# Altium project F429_CORE.PrjPcb
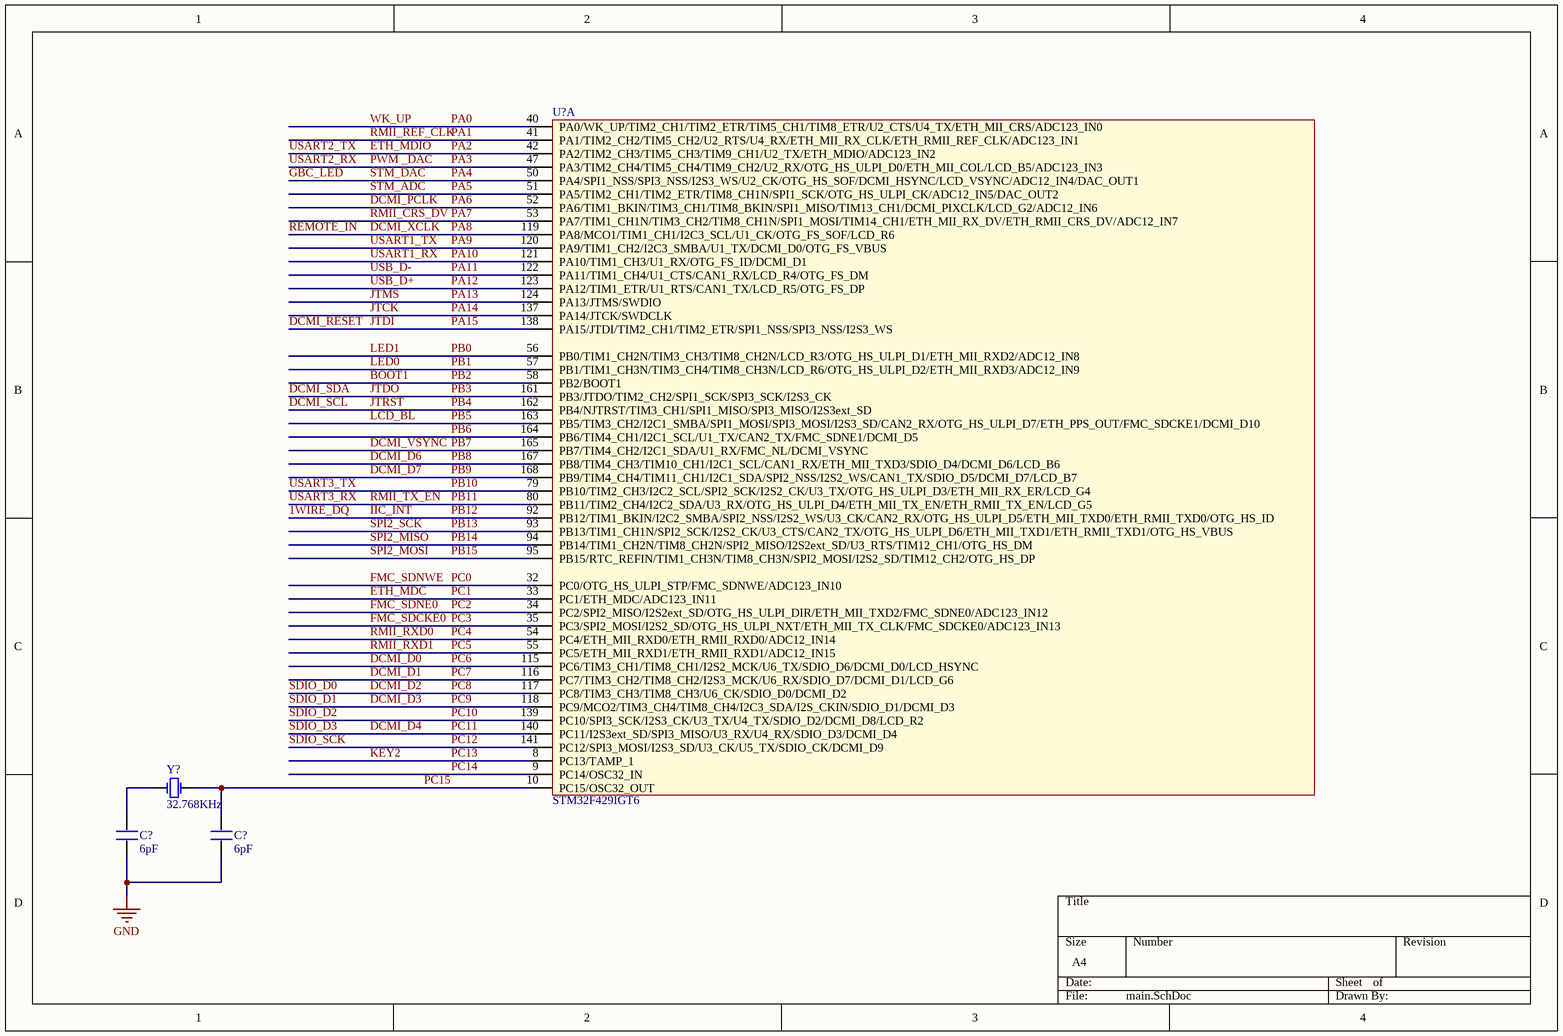
[diagram p0: main.SchDoc]
3 sheets, 26 parts. Net scope: global (net labels, ports and power ports of the same name join across sheets).
Board file: main.PcbDoc
Sheets:
  main.SchDoc
  main-2.SchDoc
  main-3.SchDoc

## Sheet main.SchDoc
size A4

### Parts
(Parts that share a designator on the sheet are numbered #1, #2 ... from top to bottom, then left to right.)
C?#1  6pF  [0402]
C?#2  6pF  [0402]
U?#1  STM32F429IGT6  [LQFP176]  (part A of 3)
Y?#1  32.768KHz  [XTAL3215]

### Nets
GND: C?#1.2 C?#2.1
1WIRE_DQ: U?#1.92(PB12/TIM1_BKIN/I2C2_SMBA/SPI2_NSS/I2S2_WS/U3_CK/CAN2_RX/OTG_HS_ULPI_D5/ETH_MII_TXD0/ETH_RMII_TXD0/OTG_HS_ID)  [also labelled IIC_INT, PB12]
BOOT1: U?#1.58(PB2/BOOT1)  [also labelled PB2]
DCMI_D0: U?#1.115(PC6/TIM3_CH1/TIM8_CH1/I2S2_MCK/U6_TX/SDIO_D6/DCMI_D0/LCD_HSYNC)  [also labelled PC6]
DCMI_D1: U?#1.116(PC7/TIM3_CH2/TIM8_CH2/I2S3_MCK/U6_RX/SDIO_D7/DCMI_D1/LCD_G6)  [also labelled PC7]
DCMI_D2: U?#1.117(PC8/TIM3_CH3/TIM8_CH3/U6_CK/SDIO_D0/DCMI_D2)  [also labelled PC8, SDIO_D0]
DCMI_D3: U?#1.118(PC9/MCO2/TIM3_CH4/TIM8_CH4/I2C3_SDA/I2S_CKIN/SDIO_D1/DCMI_D3)  [also labelled PC9, SDIO_D1]
DCMI_D4: U?#1.140(PC11/I2S3ext_SD/SPI3_MISO/U3_RX/U4_RX/SDIO_D3/DCMI_D4)  [also labelled PC11, SDIO_D3]
DCMI_D6: U?#1.167(PB8/TIM4_CH3/TIM10_CH1/I2C1_SCL/CAN1_RX/ETH_MII_TXD3/SDIO_D4/DCMI_D6/LCD_B6)  [also labelled PB8]
DCMI_D7: U?#1.168(PB9/TIM4_CH4/TIM11_CH1/I2C1_SDA/SPI2_NSS/I2S2_WS/CAN1_TX/SDIO_D5/DCMI_D7/LCD_B7)  [also labelled PB9]
DCMI_PCLK: U?#1.52(PA6/TIM1_BKIN/TIM3_CH1/TIM8_BKIN/SPI1_MISO/TIM13_CH1/DCMI_PIXCLK/LCD_G2/ADC12_IN6)  [also labelled PA6]
DCMI_RESET: U?#1.138(PA15/JTDI/TIM2_CH1/TIM2_ETR/SPI1_NSS/SPI3_NSS/I2S3_WS)  [also labelled JTDI, PA15]
DCMI_SCL: U?#1.162(PB4/NJTRST/TIM3_CH1/SPI1_MISO/SPI3_MISO/I2S3ext_SD)  [also labelled JTRST, PB4]
DCMI_SDA: U?#1.161(PB3/JTDO/TIM2_CH2/SPI1_SCK/SPI3_SCK/I2S3_CK)  [also labelled JTDO, PB3]
DCMI_VSYNC: U?#1.165(PB7/TIM4_CH2/I2C1_SDA/U1_RX/FMC_NL/DCMI_VSYNC)  [also labelled PB7]
DCMI_XCLK: U?#1.119(PA8/MCO1/TIM1_CH1/I2C3_SCL/U1_CK/OTG_FS_SOF/LCD_R6)  [also labelled PA8, REMOTE_IN]
ETH_MDC: U?#1.33(PC1/ETH_MDC/ADC123_IN11)  [also labelled PC1]
ETH_MDIO: U?#1.42(PA2/TIM2_CH3/TIM5_CH3/TIM9_CH1/U2_TX/ETH_MDIO/ADC123_IN2)  [also labelled PA2, USART2_TX]
FMC_SDCKE0: U?#1.35(PC3/SPI2_MOSI/I2S2_SD/OTG_HS_ULPI_NXT/ETH_MII_TX_CLK/FMC_SDCKE0/ADC123_IN13)  [also labelled PC3]
FMC_SDNE0: U?#1.34(PC2/SPI2_MISO/I2S2ext_SD/OTG_HS_ULPI_DIR/ETH_MII_TXD2/FMC_SDNE0/ADC123_IN12)  [also labelled PC2]
FMC_SDNWE: U?#1.32(PC0/OTG_HS_ULPI_STP/FMC_SDNWE/ADC123_IN10)  [also labelled PC0]
GBC_LED: U?#1.50(PA4/SPI1_NSS/SPI3_NSS/I2S3_WS/U2_CK/OTG_HS_SOF/DCMI_HSYNC/LCD_VSYNC/ADC12_IN4/DAC_OUT1)  [also labelled PA4, STM_DAC]
JTCK: U?#1.137(PA14/JTCK/SWDCLK)  [also labelled PA14]
JTMS: U?#1.124(PA13/JTMS/SWDIO)  [also labelled PA13]
KEY2: U?#1.8(PC13/TAMP_1)  [also labelled PC13]
LCD_BL: U?#1.163(PB5/TIM3_CH2/I2C1_SMBA/SPI1_MOSI/SPI3_MOSI/I2S3_SD/CAN2_RX/OTG_HS_ULPI_D7/ETH_PPS_OUT/FMC_SDCKE1/DCMI_D10)  [also labelled PB5]
LED0: U?#1.57(PB1/TIM1_CH3N/TIM3_CH4/TIM8_CH3N/LCD_R6/OTG_HS_ULPI_D2/ETH_MII_RXD3/ADC12_IN9)  [also labelled PB1]
LED1: U?#1.56(PB0/TIM1_CH2N/TIM3_CH3/TIM8_CH2N/LCD_R3/OTG_HS_ULPI_D1/ETH_MII_RXD2/ADC12_IN8)  [also labelled PB0]
PA0: U?#1.40(PA0/WK_UP/TIM2_CH1/TIM2_ETR/TIM5_CH1/TIM8_ETR/U2_CTS/U4_TX/ETH_MII_CRS/ADC123_IN0)  [also labelled WK_UP]
PA1: U?#1.41(PA1/TIM2_CH2/TIM5_CH2/U2_RTS/U4_RX/ETH_MII_RX_CLK/ETH_RMII_REF_CLK/ADC123_IN1)  [also labelled RMII_REF_CLK]
PA3: U?#1.47(PA3/TIM2_CH4/TIM5_CH4/TIM9_CH2/U2_RX/OTG_HS_ULPI_D0/ETH_MII_COL/LCD_B5/ADC123_IN3)  [also labelled PWM _DAC, USART2_RX]
PA5: U?#1.51(PA5/TIM2_CH1/TIM2_ETR/TIM8_CH1N/SPI1_SCK/OTG_HS_ULPI_CK/ADC12_IN5/DAC_OUT2)  [also labelled STM_ADC]
PA7: U?#1.53(PA7/TIM1_CH1N/TIM3_CH2/TIM8_CH1N/SPI1_MOSI/TIM14_CH1/ETH_MII_RX_DV/ETH_RMII_CRS_DV/ADC12_IN7)  [also labelled RMII_CRS_DV]
PA9: U?#1.120(PA9/TIM1_CH2/I2C3_SMBA/U1_TX/DCMI_D0/OTG_FS_VBUS)  [also labelled USART1_TX]
PA10: U?#1.121(PA10/TIM1_CH3/U1_RX/OTG_FS_ID/DCMI_D1)  [also labelled USART1_RX]
PA11: U?#1.122(PA11/TIM1_CH4/U1_CTS/CAN1_RX/LCD_R4/OTG_FS_DM)  [also labelled USB_D-]
PA12: U?#1.123(PA12/TIM1_ETR/U1_RTS/CAN1_TX/LCD_R5/OTG_FS_DP)  [also labelled USB_D+]
PB6: U?#1.164(PB6/TIM4_CH1/I2C1_SCL/U1_TX/CAN2_TX/FMC_SDNE1/DCMI_D5)
PB10: U?#1.79(PB10/TIM2_CH3/I2C2_SCL/SPI2_SCK/I2S2_CK/U3_TX/OTG_HS_ULPI_D3/ETH_MII_RX_ER/LCD_G4)  [also labelled USART3_TX]
PB11: U?#1.80(PB11/TIM2_CH4/I2C2_SDA/U3_RX/OTG_HS_ULPI_D4/ETH_MII_TX_EN/ETH_RMII_TX_EN/LCD_G5)  [also labelled RMII_TX_EN, USART3_RX]
PB13: U?#1.93(PB13/TIM1_CH1N/SPI2_SCK/I2S2_CK/U3_CTS/CAN2_TX/OTG_HS_ULPI_D6/ETH_MII_TXD1/ETH_RMII_TXD1/OTG_HS_VBUS)  [also labelled SPI2_SCK]
PB14: U?#1.94(PB14/TIM1_CH2N/TIM8_CH2N/SPI2_MISO/I2S2ext_SD/U3_RTS/TIM12_CH1/OTG_HS_DM)  [also labelled SPI2_MISO]
PB15: U?#1.95(PB15/RTC_REFIN/TIM1_CH3N/TIM8_CH3N/SPI2_MOSI/I2S2_SD/TIM12_CH2/OTG_HS_DP)  [also labelled SPI2_MOSI]
PC4: U?#1.54(PC4/ETH_MII_RXD0/ETH_RMII_RXD0/ADC12_IN14)  [also labelled RMII_RXD0]
PC5: U?#1.55(PC5/ETH_MII_RXD1/ETH_RMII_RXD1/ADC12_IN15)  [also labelled RMII_RXD1]
PC10: U?#1.139(PC10/SPI3_SCK/I2S3_CK/U3_TX/U4_TX/SDIO_D2/DCMI_D8/LCD_R2)  [also labelled SDIO_D2]
PC12: U?#1.141(PC12/SPI3_MOSI/I2S3_SD/U3_CK/U5_TX/SDIO_CK/DCMI_D9)  [also labelled SDIO_SCK]
PC14: U?#1.9(PC14/OSC32_IN)
PC15: C?#2.2 U?#1.10(PC15/OSC32_OUT) Y?#1.2(OSC2)
NetC?#1_1: C?#1.1 Y?#1.1(OSC1)

### Library data of the parts
C?#1 C?#2 = CAP
U?#1 = STM32F429IGT6: 意法半导体MCU M4内核
Y?#1 = XTAL: 普通晶振; Published: 8-Jun-2000; LatestRevisionDate: 17-Jul-2002; LatestRevisionNote: Re-released for DXP Platform.; Publisher: Altium Limited

## Sheet main-2.SchDoc
size A4
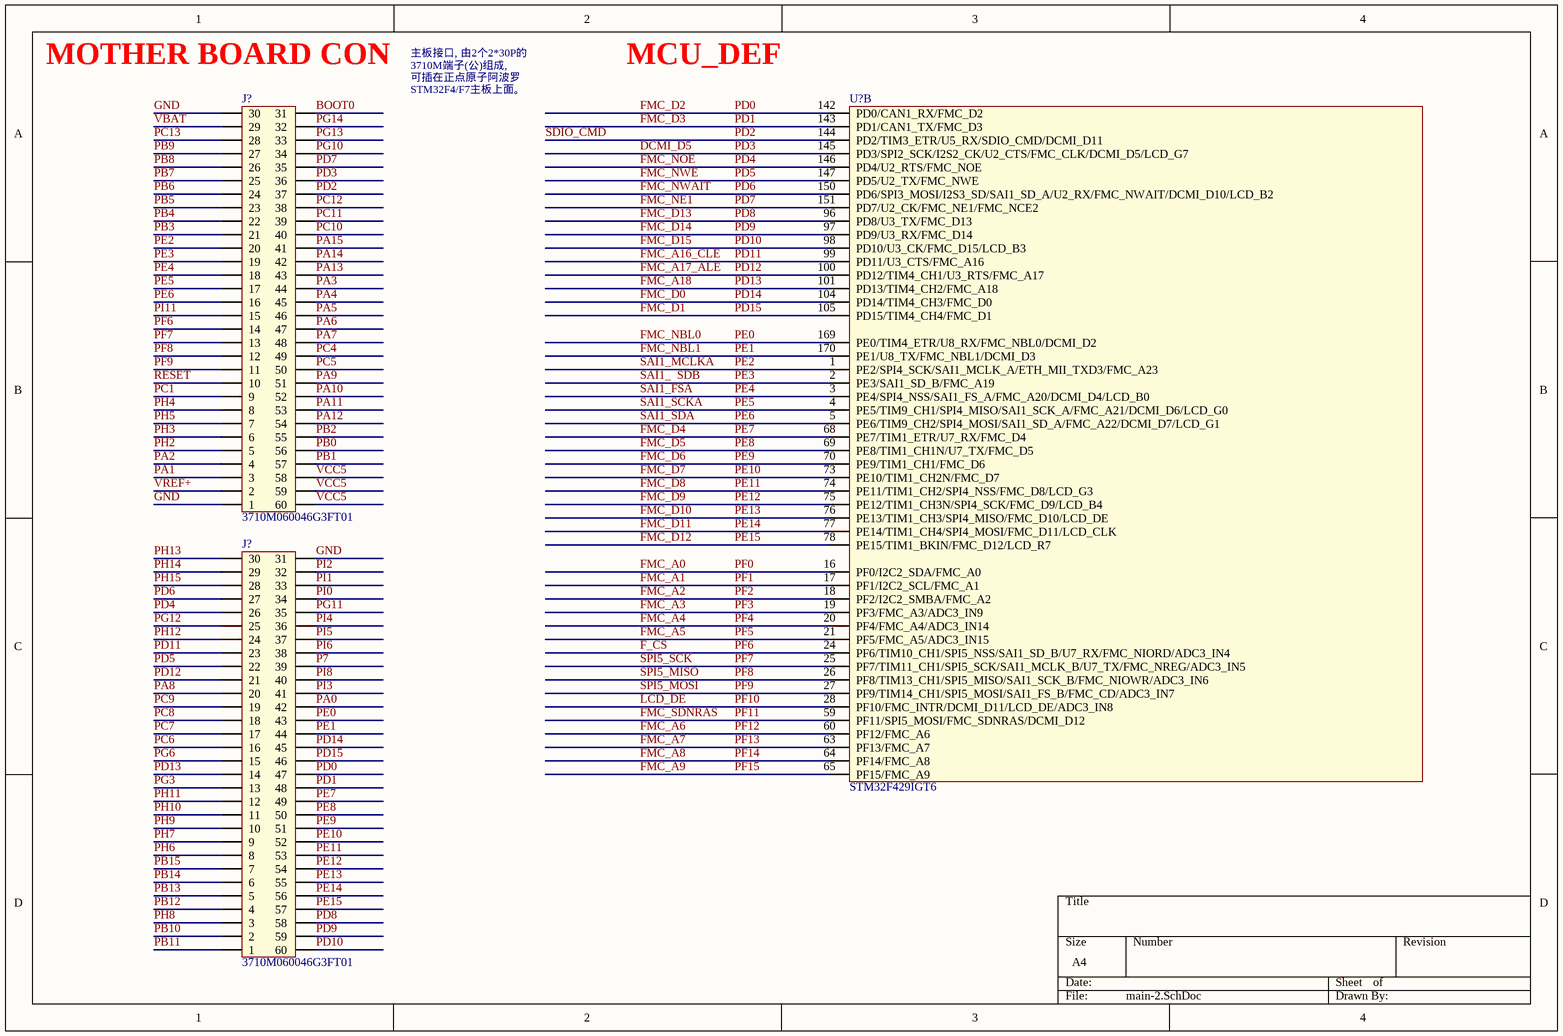
[diagram p1: main-2.SchDoc]

### Parts
(Parts that share a designator on the sheet are numbered #1, #2 ... from top to bottom, then left to right.)
J?#1  3710M060046G3FT01  [3710F060046G3FT01]
J?#2  3710M060046G3FT01  [3710F060046G3FT01]
U?#2  STM32F429IGT6  [LQFP176]  (part B of 3)

### Nets
GND: J?#1.1 J?#1.30 J?#2.31
BOOT0: J?#1.31
DCMI_D5: J?#1.36 U?#2.145(PD3/SPI2_SCK/I2S2_CK/U2_CTS/FMC_CLK/DCMI_D5/LCD_G7)  [also labelled PD3]
F_CS: J?#1.14 U?#2.24(PF6/TIM10_CH1/SPI5_NSS/SAI1_SD_B/U7_RX/FMC_NIORD/ADC3_IN4)  [also labelled PF6]
FMC_A0: U?#2.16(PF0/I2C2_SDA/FMC_A0)  [also labelled PF0]
FMC_A1: U?#2.17(PF1/I2C2_SCL/FMC_A1)  [also labelled PF1]
FMC_A2: U?#2.18(PF2/I2C2_SMBA/FMC_A2)  [also labelled PF2]
FMC_A3: U?#2.19(PF3/FMC_A3/ADC3_IN9)  [also labelled PF3]
FMC_A4: U?#2.20(PF4/FMC_A4/ADC3_IN14)  [also labelled PF4]
FMC_A5: U?#2.21(PF5/FMC_A5/ADC3_IN15)  [also labelled PF5]
FMC_A6: U?#2.60(PF12/FMC_A6)  [also labelled PF12]
FMC_A7: U?#2.63(PF13/FMC_A7)  [also labelled PF13]
FMC_A8: U?#2.64(PF14/FMC_A8)  [also labelled PF14]
FMC_A9: U?#2.65(PF15/FMC_A9)  [also labelled PF15]
FMC_A16_CLE: J?#2.23 U?#2.99(PD11/U3_CTS/FMC_A16)  [also labelled PD11]
FMC_A17_ALE: J?#2.21 U?#2.100(PD12/TIM4_CH1/U3_RTS/FMC_A17)  [also labelled PD12]
FMC_A18: J?#2.14 U?#2.101(PD13/TIM4_CH2/FMC_A18)  [also labelled PD13]
FMC_D0: J?#2.45 U?#2.104(PD14/TIM4_CH3/FMC_D0)  [also labelled PD14]
FMC_D1: J?#2.46 U?#2.105(PD15/TIM4_CH4/FMC_D1)  [also labelled PD15]
FMC_D2: J?#2.47 U?#2.142(PD0/CAN1_RX/FMC_D2)  [also labelled PD0]
FMC_D3: J?#2.48 U?#2.143(PD1/CAN1_TX/FMC_D3)  [also labelled PD1]
FMC_D4: J?#2.49 U?#2.68(PE7/TIM1_ETR/U7_RX/FMC_D4)  [also labelled PE7]
FMC_D5: J?#2.50 U?#2.69(PE8/TIM1_CH1N/U7_TX/FMC_D5)  [also labelled PE8]
FMC_D6: J?#2.51 U?#2.70(PE9/TIM1_CH1/FMC_D6)  [also labelled PE9]
FMC_D7: J?#2.52 U?#2.73(PE10/TIM1_CH2N/FMC_D7)  [also labelled PE10]
FMC_D8: J?#2.53 U?#2.74(PE11/TIM1_CH2/SPI4_NSS/FMC_D8/LCD_G3)  [also labelled PE11]
FMC_D9: J?#2.54 U?#2.75(PE12/TIM1_CH3N/SPI4_SCK/FMC_D9/LCD_B4)  [also labelled PE12]
FMC_D10: J?#2.55 U?#2.76(PE13/TIM1_CH3/SPI4_MISO/FMC_D10/LCD_DE)  [also labelled PE13]
FMC_D11: J?#2.56 U?#2.77(PE14/TIM1_CH4/SPI4_MOSI/FMC_D11/LCD_CLK)  [also labelled PE14]
FMC_D12: J?#2.57 U?#2.78(PE15/TIM1_BKIN/FMC_D12/LCD_R7)  [also labelled PE15]
FMC_D13: J?#2.58 U?#2.96(PD8/U3_TX/FMC_D13)  [also labelled PD8]
FMC_D14: J?#2.59 U?#2.97(PD9/U3_RX/FMC_D14)  [also labelled PD9]
FMC_D15: J?#2.60 U?#2.98(PD10/U3_CK/FMC_D15/LCD_B3)  [also labelled PD10]
FMC_NBL0: J?#2.43 U?#2.169(PE0/TIM4_ETR/U8_RX/FMC_NBL0/DCMI_D2)  [also labelled PE0]
FMC_NBL1: J?#2.44 U?#2.170(PE1/U8_TX/FMC_NBL1/DCMI_D3)  [also labelled PE1]
FMC_NE1: J?#1.35 U?#2.151(PD7/U2_CK/FMC_NE1/FMC_NCE2)  [also labelled PD7]
FMC_NOE: J?#2.26 U?#2.146(PD4/U2_RTS/FMC_NOE)  [also labelled PD4]
FMC_NWAIT: J?#2.27 U?#2.150(PD6/SPI3_MOSI/I2S3_SD/SAI1_SD_A/U2_RX/FMC_NWAIT/DCMI_D10/LCD_B2)  [also labelled PD6]
FMC_NWE: J?#2.22 U?#2.147(PD5/U2_TX/FMC_NWE)  [also labelled PD5]
FMC_SDNRAS: U?#2.59(PF11/SPI5_MOSI/FMC_SDNRAS/DCMI_D12)  [also labelled PF11]
LCD_DE: U?#2.28(PF10/FMC_INTR/DCMI_D11/LCD_DE/ADC3_IN8)  [also labelled PF10]
P7: J?#2.39
PA0: J?#2.42
PA1: J?#1.3
PA2: J?#1.4  [project net ETH_MDIO]
PA3: J?#1.44
PA4: J?#1.45  [project net GBC_LED]
PA5: J?#1.46
PA6: J?#1.47  [project net DCMI_PCLK]
PA7: J?#1.48
PA8: J?#2.20  [project net DCMI_XCLK]
PA9: J?#1.51
PA10: J?#1.52
PA11: J?#1.53
PA12: J?#1.54
PA13: J?#1.43  [project net JTMS]
PA14: J?#1.42  [project net JTCK]
PA15: J?#1.41  [project net DCMI_RESET]
PB0: J?#1.56  [project net LED1]
PB1: J?#1.57  [project net LED0]
PB2: J?#1.55  [project net BOOT1]
PB3: J?#1.21  [project net DCMI_SDA]
PB4: J?#1.22  [project net DCMI_SCL]
PB5: J?#1.23  [project net LCD_BL]
PB6: J?#1.24
PB7: J?#1.25  [project net DCMI_VSYNC]
PB8: J?#1.26  [project net DCMI_D6]
PB9: J?#1.27  [project net DCMI_D7]
PB10: J?#2.2
PB11: J?#2.1
PB12: J?#2.4  [project net 1WIRE_DQ]
PB13: J?#2.5
PB14: J?#2.6
PB15: J?#2.7
PC1: J?#1.9  [project net ETH_MDC]
PC4: J?#1.49
PC5: J?#1.50
PC6: J?#2.16  [project net DCMI_D0]
PC7: J?#2.17  [project net DCMI_D1]
PC8: J?#2.18  [project net DCMI_D2]
PC9: J?#2.19  [project net DCMI_D3]
PC10: J?#1.40
PC11: J?#1.39  [project net DCMI_D4]
PC12: J?#1.38
PC13: J?#1.28  [project net KEY2]
PD2: J?#1.37 U?#2.144(PD2/TIM3_ETR/U5_RX/SDIO_CMD/DCMI_D11)  [also labelled SDIO_CMD]
PE2: J?#1.20 U?#2.1(PE2/SPI4_SCK/SAI1_MCLK_A/ETH_MII_TXD3/FMC_A23)  [also labelled SAI1_MCLKA]
PE3: J?#1.19 U?#2.2(PE3/SAI1_SD_B/FMC_A19)  [also labelled SAI1_  SDB]
PE4: J?#1.18 U?#2.3(PE4/SPI4_NSS/SAI1_FS_A/FMC_A20/DCMI_D4/LCD_B0)  [also labelled SAI1_FSA]
PE5: J?#1.17 U?#2.4(PE5/TIM9_CH1/SPI4_MISO/SAI1_SCK_A/FMC_A21/DCMI_D6/LCD_G0)  [also labelled SAI1_SCKA]
PE6: J?#1.16 U?#2.5(PE6/TIM9_CH2/SPI4_MOSI/SAI1_SD_A/FMC_A22/DCMI_D7/LCD_G1)  [also labelled SAI1_SDA]
PF7: J?#1.13 U?#2.25(PF7/TIM11_CH1/SPI5_SCK/SAI1_MCLK_B/U7_TX/FMC_NREG/ADC3_IN5)  [also labelled SPI5_SCK]
PF8: J?#1.12 U?#2.26(PF8/TIM13_CH1/SPI5_MISO/SAI1_SCK_B/FMC_NIOWR/ADC3_IN6)  [also labelled SPI5_MISO]
PF9: J?#1.11 U?#2.27(PF9/TIM14_CH1/SPI5_MOSI/SAI1_FS_B/FMC_CD/ADC3_IN7)  [also labelled SPI5_MOSI]
PG3: J?#2.13
PG6: J?#2.15  [project net LCD_R7]
PG10: J?#1.34  [project net NR~{F}_CS]
PG11: J?#2.35  [project net LCD_B3]
PG12: J?#2.25  [project net NRF_CE]
PG13: J?#1.33
PG14: J?#1.32
PH2: J?#1.5  [project net KEY1]
PH3: J?#1.6  [project net KEY0]
PH4: J?#1.8  [project net IIC_SCL]
PH5: J?#1.7  [project net IIC_SDA]
PH6: J?#2.8
PH7: J?#2.9
PH8: J?#2.3  [project net DCMI_HREF]
PH9: J?#2.10  [project net LCD_R3]
PH10: J?#2.11  [project net LCD_R4]
PH11: J?#2.12  [project net LCD_R5]
PH12: J?#2.24  [project net LCD_R6]
PH13: J?#2.30  [project net LCD_G2]
PH14: J?#2.29  [project net LCD_G3]
PH15: J?#2.28  [project net LCD_G4]
PI0: J?#2.34  [project net LCD_G5]
PI1: J?#2.33  [project net LCD_G6]
PI2: J?#2.32  [project net LCD_G7]
PI3: J?#2.41
PI4: J?#2.36  [project net LCD_B4]
PI5: J?#2.37  [project net LCD_B5]
PI6: J?#2.38  [project net LCD_B6]
PI8: J?#2.40
PI11: J?#1.15  [project net GBC_KEY]
RESET: J?#1.10
VBAT: J?#1.29
VCC5: J?#1.58 J?#1.59 J?#1.60
VREF+: J?#1.2

### Notes on the sheet
- (near J?#1) MOTHER BOARD CON
- MCU_DEF
- 主板接口, 由2个2*30P的3710M端子(公)组成,
  可插在正点原子阿波罗STM32F4/F7主板上面。

### Library data of the parts
J?#1 J?#2 = 3710F: 3710F060046G3FT01
U?#2 = STM32F429IGT6: 意法半导体MCU M4内核

## Sheet main-3.SchDoc
size A4
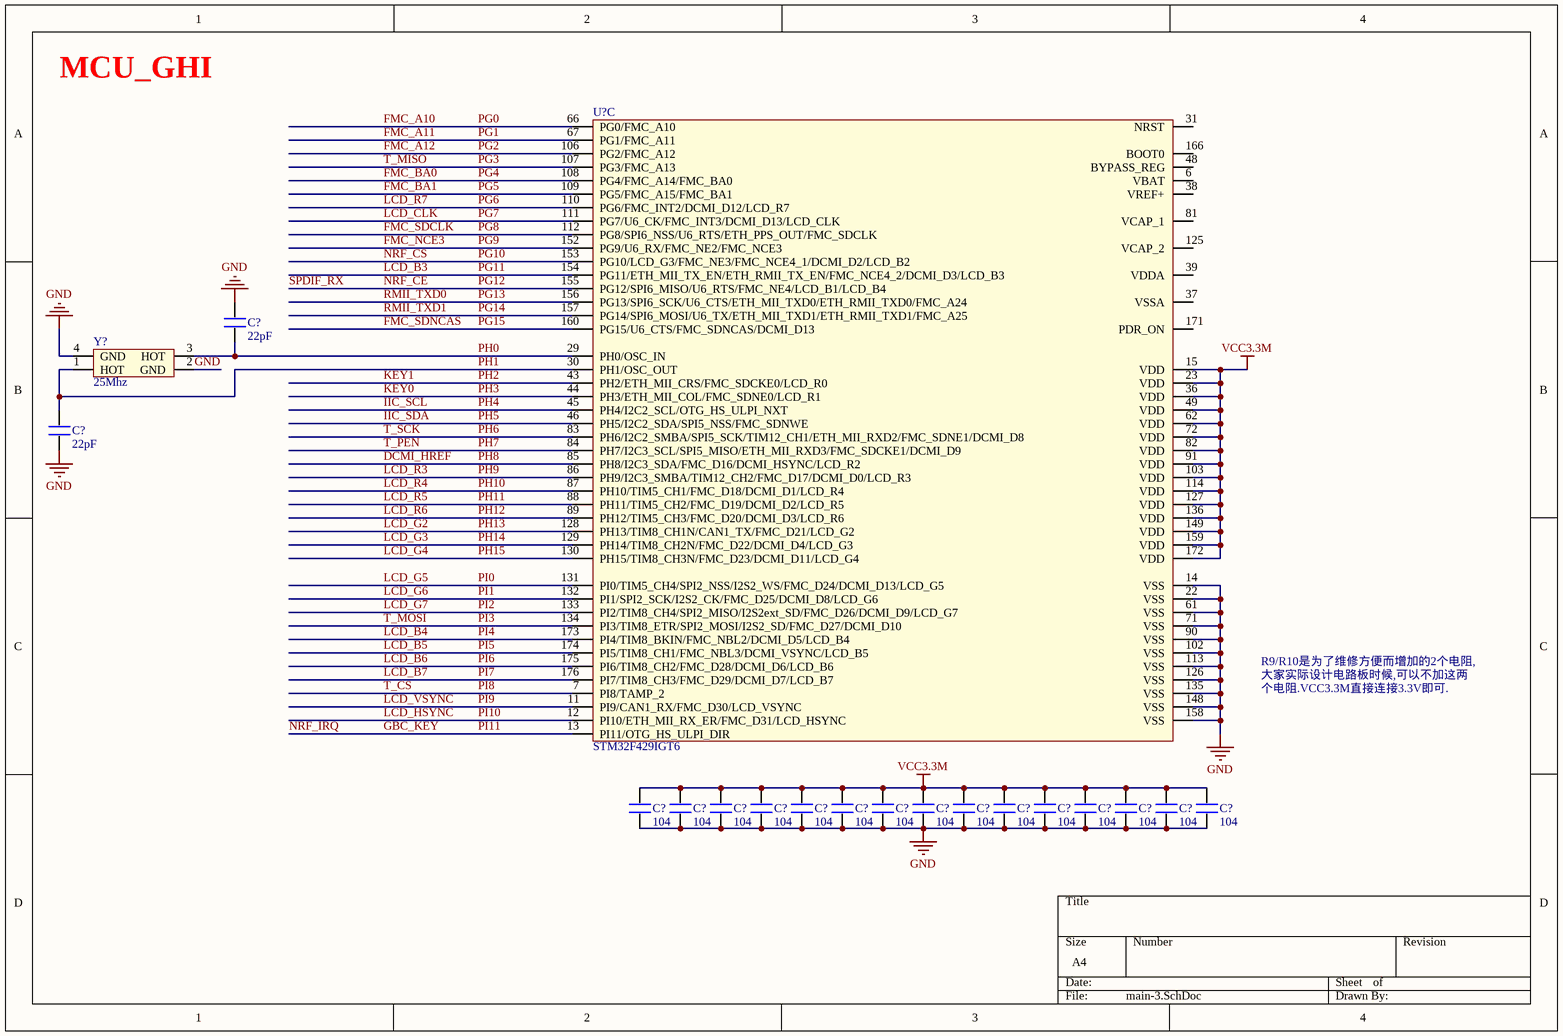
[diagram p2: main-3.SchDoc]

### Parts
(Parts that share a designator on the sheet are numbered #1, #2 ... from top to bottom, then left to right.)
C?#3  22pF  [0402]
C?#4  22pF  [0402]
C?#5  104  [0402]
C?#6  104  [0402]
C?#7  104  [0402]
C?#8  104  [0402]
C?#9  104  [0402]
C?#10  104  [0402]
C?#11  104  [0402]
C?#12  104  [0402]
C?#13  104  [0402]
C?#14  104  [0402]
C?#15  104  [0402]
C?#16  104  [0402]
C?#17  104  [0402]
C?#18  104  [0402]
C?#19  104  [0402]
U?#3  STM32F429IGT6  [LQFP176]  (part C of 3)
Y?#2  25Mhz  [XTAL3225]

### Nets
GND: C?#3.2 C?#4.1 C?#5.1 C?#6.1 C?#7.1 C?#8.1 C?#9.1 C?#10.1 C?#11.1 C?#12.1 C?#13.1 C?#14.1 C?#15.1 C?#16.1 C?#17.1 C?#18.1 C?#19.1 U?#3.14(VSS) U?#3.22(VSS) U?#3.61(VSS) U?#3.71(VSS) U?#3.90(VSS) U?#3.102(VSS) U?#3.113(VSS) U?#3.126(VSS) U?#3.135(VSS) U?#3.148(VSS) U?#3.158(VSS) Y?#2.2(GND) Y?#2.4(GND)
VCC3.3M: C?#5.2 C?#6.2 C?#7.2 C?#8.2 C?#9.2 C?#10.2 C?#11.2 C?#12.2 C?#13.2 C?#14.2 C?#15.2 C?#16.2 C?#17.2 C?#18.2 C?#19.2 U?#3.15(VDD) U?#3.23(VDD) U?#3.36(VDD) U?#3.49(VDD) U?#3.62(VDD) U?#3.72(VDD) U?#3.82(VDD) U?#3.91(VDD) U?#3.103(VDD) U?#3.114(VDD) U?#3.127(VDD) U?#3.136(VDD) U?#3.149(VDD) U?#3.159(VDD) U?#3.172(VDD)
DCMI_HREF: U?#3.85(PH8/I2C3_SDA/FMC_D16/DCMI_HSYNC/LCD_R2)  [also labelled PH8]
~{F}MC_SDCLK: U?#3.112(PG8/SPI6_NSS/U6_RTS/ETH_PPS_OUT/FMC_SDCLK)  [also labelled PG8]
FMC_A10: U?#3.66(PG0/FMC_A10)  [also labelled PG0]
FMC_A11: U?#3.67(PG1/FMC_A11)  [also labelled PG1]
FMC_A12: U?#3.106(PG2/FMC_A12)  [also labelled PG2]
FMC_BA0: U?#3.108(PG4/FMC_A14/FMC_BA0)  [also labelled PG4]
FMC_BA1: U?#3.109(PG5/FMC_A15/FMC_BA1)  [also labelled PG5]
FMC_NCE3: U?#3.152(PG9/U6_RX/FMC_NE2/FMC_NCE3)  [also labelled PG9]
FMC_SDNCAS: U?#3.160(PG15/U6_CTS/FMC_SDNCAS/DCMI_D13)  [also labelled PG15]
GBC_KEY: U?#3.13(PI11/OTG_HS_ULPI_DIR)  [also labelled NRF_IRQ, PI11]
IIC_SCL: U?#3.45(PH4/I2C2_SCL/OTG_HS_ULPI_NXT)  [also labelled PH4]
IIC_SDA: U?#3.46(PH5/I2C2_SDA/SPI5_NSS/FMC_SDNWE)  [also labelled PH5]
KEY0: U?#3.44(PH3/ETH_MII_COL/FMC_SDNE0/LCD_R1)  [also labelled PH3]
KEY1: U?#3.43(PH2/ETH_MII_CRS/FMC_SDCKE0/LCD_R0)  [also labelled PH2]
LCD_B3: U?#3.154(PG11/ETH_MII_TX_EN/ETH_RMII_TX_EN/FMC_NCE4_2/DCMI_D3/LCD_B3)  [also labelled PG11]
LCD_B4: U?#3.173(PI4/TIM8_BKIN/FMC_NBL2/DCMI_D5/LCD_B4)  [also labelled PI4]
LCD_B5: U?#3.174(PI5/TIM8_CH1/FMC_NBL3/DCMI_VSYNC/LCD_B5)  [also labelled PI5]
LCD_B6: U?#3.175(PI6/TIM8_CH2/FMC_D28/DCMI_D6/LCD_B6)  [also labelled PI6]
LCD_B7: U?#3.176(PI7/TIM8_CH3/FMC_D29/DCMI_D7/LCD_B7)  [also labelled PI7]
LCD_CLK: U?#3.111(PG7/U6_CK/FMC_INT3/DCMI_D13/LCD_CLK)  [also labelled PG~{7}]
LCD_G2: U?#3.128(PH13/TIM8_CH1N/CAN1_TX/FMC_D21/LCD_G2)  [also labelled PH13]
LCD_G3: U?#3.129(PH14/TIM8_CH2N/FMC_D22/DCMI_D4/LCD_G3)  [also labelled PH14]
LCD_G4: U?#3.130(PH15/TIM8_CH3N/FMC_D23/DCMI_D11/LCD_G4)  [also labelled PH15]
LCD_G5: U?#3.131(PI0/TIM5_CH4/SPI2_NSS/I2S2_WS/FMC_D24/DCMI_D13/LCD_G5)  [also labelled PI0]
LCD_G6: U?#3.132(PI1/SPI2_SCK/I2S2_CK/FMC_D25/DCMI_D8/LCD_G6)  [also labelled PI1]
LCD_G7: U?#3.133(PI2/TIM8_CH4/SPI2_MISO/I2S2ext_SD/FMC_D26/DCMI_D9/LCD_G7)  [also labelled PI2]
LCD_HSYNC: U?#3.12(PI10/ETH_MII_RX_ER/FMC_D31/LCD_HSYNC)  [also labelled PI10]
LCD_R3: U?#3.86(PH9/I2C3_SMBA/TIM12_CH2/FMC_D17/DCMI_D0/LCD_R3)  [also labelled PH9]
LCD_R4: U?#3.87(PH10/TIM5_CH1/FMC_D18/DCMI_D1/LCD_R4)  [also labelled PH10]
LCD_R5: U?#3.88(PH11/TIM5_CH2/FMC_D19/DCMI_D2/LCD_R5)  [also labelled PH11]
LCD_R6: U?#3.89(PH12/TIM5_CH3/FMC_D20/DCMI_D3/LCD_R6)  [also labelled PH12]
LCD_R7: U?#3.110(PG6/FMC_INT2/DCMI_D12/LCD_R7)  [also labelled PG6]
LCD_VSYNC: U?#3.11(PI9/CAN1_RX/FMC_D30/LCD_VSYNC)  [also labelled PI9]
NR~{F}_CS: U?#3.153(PG10/LCD_G3/FMC_NE3/FMC_NCE4_1/DCMI_D2/LCD_B2)  [also labelled PG10]
NRF_CE: U?#3.155(PG12/SPI6_MISO/U6_RTS/FMC_NE4/LCD_B1/LCD_B4)  [also labelled PG12, SPDIF_RX]
PG3: U?#3.107(PG3/FMC_A13)  [also labelled T_MISO]
PG13: U?#3.156(PG13/SPI6_SCK/U6_CTS/ETH_MII_TXD0/ETH_RMII_TXD0/FMC_A24)  [also labelled RMII_TXD0]
PG14: U?#3.157(PG14/SPI6_MOSI/U6_TX/ETH_MII_TXD1/ETH_RMII_TXD1/FMC_A25)  [also labelled RMII_TXD1]
PH0: C?#3.1 U?#3.29(PH0/OSC_IN) Y?#2.3(HOT)
PH1: C?#4.2 U?#3.30(PH1/OSC_OUT) Y?#2.1(HOT)
PH6: U?#3.83(PH6/I2C2_SMBA/SPI5_SCK/TIM12_CH1/ETH_MII_RXD2/FMC_SDNE1/DCMI_D8)  [also labelled T_SCK]
PH7: U?#3.84(PH7/I2C3_SCL/SPI5_MISO/ETH_MII_RXD3/FMC_SDCKE1/DCMI_D9)  [also labelled T_PEN]
PI3: U?#3.134(PI3/TIM8_ETR/SPI2_MOSI/I2S2_SD/FMC_D27/DCMI_D10)  [also labelled T_MOSI]
PI8: U?#3.7(PI8/TAMP_2)  [also labelled T_CS]

Not connected (* = marked no-connect by the designer): U?#3 6(VBAT) 31(NRST) 37(VSSA) 38(VREF+) 39(VDDA) 48(BYPASS_REG) 81(VCAP_1) 125(VCAP_2) 166(BOOT0) 171(PDR_ON)

### Notes on the sheet
- MCU_GHI
- R9/R10是为了维修方便而增加的2个电阻,大家实际设计电路板时候,可以不加这两个电阻.VCC3.3M直接连接3.3V即可.

### Library data of the parts
C?#3-C?#19 = CAP
U?#3 = STM32F429IGT6: 意法半导体MCU M4内核
Y?#2 = XTAL_3225: 3225贴片无源晶振

## Nets that join several sheets
GND: main (C?#1.2 C?#2.1), main-2 (J?#1.1 J?#1.30 J?#2.31), main-3 (30 pins)
1WIRE_DQ: main (U?#1.92), main-2 (J?#2.4)
BOOT1: main (U?#1.58), main-2 (J?#1.55)
DCMI_D0: main (U?#1.115), main-2 (J?#2.16)
DCMI_D1: main (U?#1.116), main-2 (J?#2.17)
DCMI_D2: main (U?#1.117), main-2 (J?#2.18)
DCMI_D3: main (U?#1.118), main-2 (J?#2.19)
DCMI_D4: main (U?#1.140), main-2 (J?#1.39)
DCMI_D6: main (U?#1.167), main-2 (J?#1.26)
DCMI_D7: main (U?#1.168), main-2 (J?#1.27)
DCMI_HREF: main-2 (J?#2.3), main-3 (U?#3.85)
DCMI_PCLK: main (U?#1.52), main-2 (J?#1.47)
DCMI_RESET: main (U?#1.138), main-2 (J?#1.41)
DCMI_SCL: main (U?#1.162), main-2 (J?#1.22)
DCMI_SDA: main (U?#1.161), main-2 (J?#1.21)
DCMI_VSYNC: main (U?#1.165), main-2 (J?#1.25)
DCMI_XCLK: main (U?#1.119), main-2 (J?#2.20)
ETH_MDC: main (U?#1.33), main-2 (J?#1.9)
ETH_MDIO: main (U?#1.42), main-2 (J?#1.4)
GBC_KEY: main-2 (J?#1.15), main-3 (U?#3.13)
GBC_LED: main (U?#1.50), main-2 (J?#1.45)
IIC_SCL: main-2 (J?#1.8), main-3 (U?#3.45)
IIC_SDA: main-2 (J?#1.7), main-3 (U?#3.46)
JTCK: main (U?#1.137), main-2 (J?#1.42)
JTMS: main (U?#1.124), main-2 (J?#1.43)
KEY0: main-2 (J?#1.6), main-3 (U?#3.44)
KEY1: main-2 (J?#1.5), main-3 (U?#3.43)
KEY2: main (U?#1.8), main-2 (J?#1.28)
LCD_B3: main-2 (J?#2.35), main-3 (U?#3.154)
LCD_B4: main-2 (J?#2.36), main-3 (U?#3.173)
LCD_B5: main-2 (J?#2.37), main-3 (U?#3.174)
LCD_B6: main-2 (J?#2.38), main-3 (U?#3.175)
LCD_BL: main (U?#1.163), main-2 (J?#1.23)
LCD_G2: main-2 (J?#2.30), main-3 (U?#3.128)
LCD_G3: main-2 (J?#2.29), main-3 (U?#3.129)
LCD_G4: main-2 (J?#2.28), main-3 (U?#3.130)
LCD_G5: main-2 (J?#2.34), main-3 (U?#3.131)
LCD_G6: main-2 (J?#2.33), main-3 (U?#3.132)
LCD_G7: main-2 (J?#2.32), main-3 (U?#3.133)
LCD_R3: main-2 (J?#2.10), main-3 (U?#3.86)
LCD_R4: main-2 (J?#2.11), main-3 (U?#3.87)
LCD_R5: main-2 (J?#2.12), main-3 (U?#3.88)
LCD_R6: main-2 (J?#2.24), main-3 (U?#3.89)
LCD_R7: main-2 (J?#2.15), main-3 (U?#3.110)
LED0: main (U?#1.57), main-2 (J?#1.57)
LED1: main (U?#1.56), main-2 (J?#1.56)
NR~{F}_CS: main-2 (J?#1.34), main-3 (U?#3.153)
NRF_CE: main-2 (J?#2.25), main-3 (U?#3.155)
PA0: main (U?#1.40), main-2 (J?#2.42)
PA1: main (U?#1.41), main-2 (J?#1.3)
PA3: main (U?#1.47), main-2 (J?#1.44)
PA5: main (U?#1.51), main-2 (J?#1.46)
PA7: main (U?#1.53), main-2 (J?#1.48)
PA9: main (U?#1.120), main-2 (J?#1.51)
PA10: main (U?#1.121), main-2 (J?#1.52)
PA11: main (U?#1.122), main-2 (J?#1.53)
PA12: main (U?#1.123), main-2 (J?#1.54)
PB6: main (U?#1.164), main-2 (J?#1.24)
PB10: main (U?#1.79), main-2 (J?#2.2)
PB11: main (U?#1.80), main-2 (J?#2.1)
PB13: main (U?#1.93), main-2 (J?#2.5)
PB14: main (U?#1.94), main-2 (J?#2.6)
PB15: main (U?#1.95), main-2 (J?#2.7)
PC4: main (U?#1.54), main-2 (J?#1.49)
PC5: main (U?#1.55), main-2 (J?#1.50)
PC10: main (U?#1.139), main-2 (J?#1.40)
PC12: main (U?#1.141), main-2 (J?#1.38)
PG3: main-2 (J?#2.13), main-3 (U?#3.107)
PG13: main-2 (J?#1.33), main-3 (U?#3.156)
PG14: main-2 (J?#1.32), main-3 (U?#3.157)
PH6: main-2 (J?#2.8), main-3 (U?#3.83)
PH7: main-2 (J?#2.9), main-3 (U?#3.84)
PI3: main-2 (J?#2.41), main-3 (U?#3.134)
PI8: main-2 (J?#2.40), main-3 (U?#3.7)